# EAGLE design LM13700 VCA exp only (EAGLE 7.4.0)
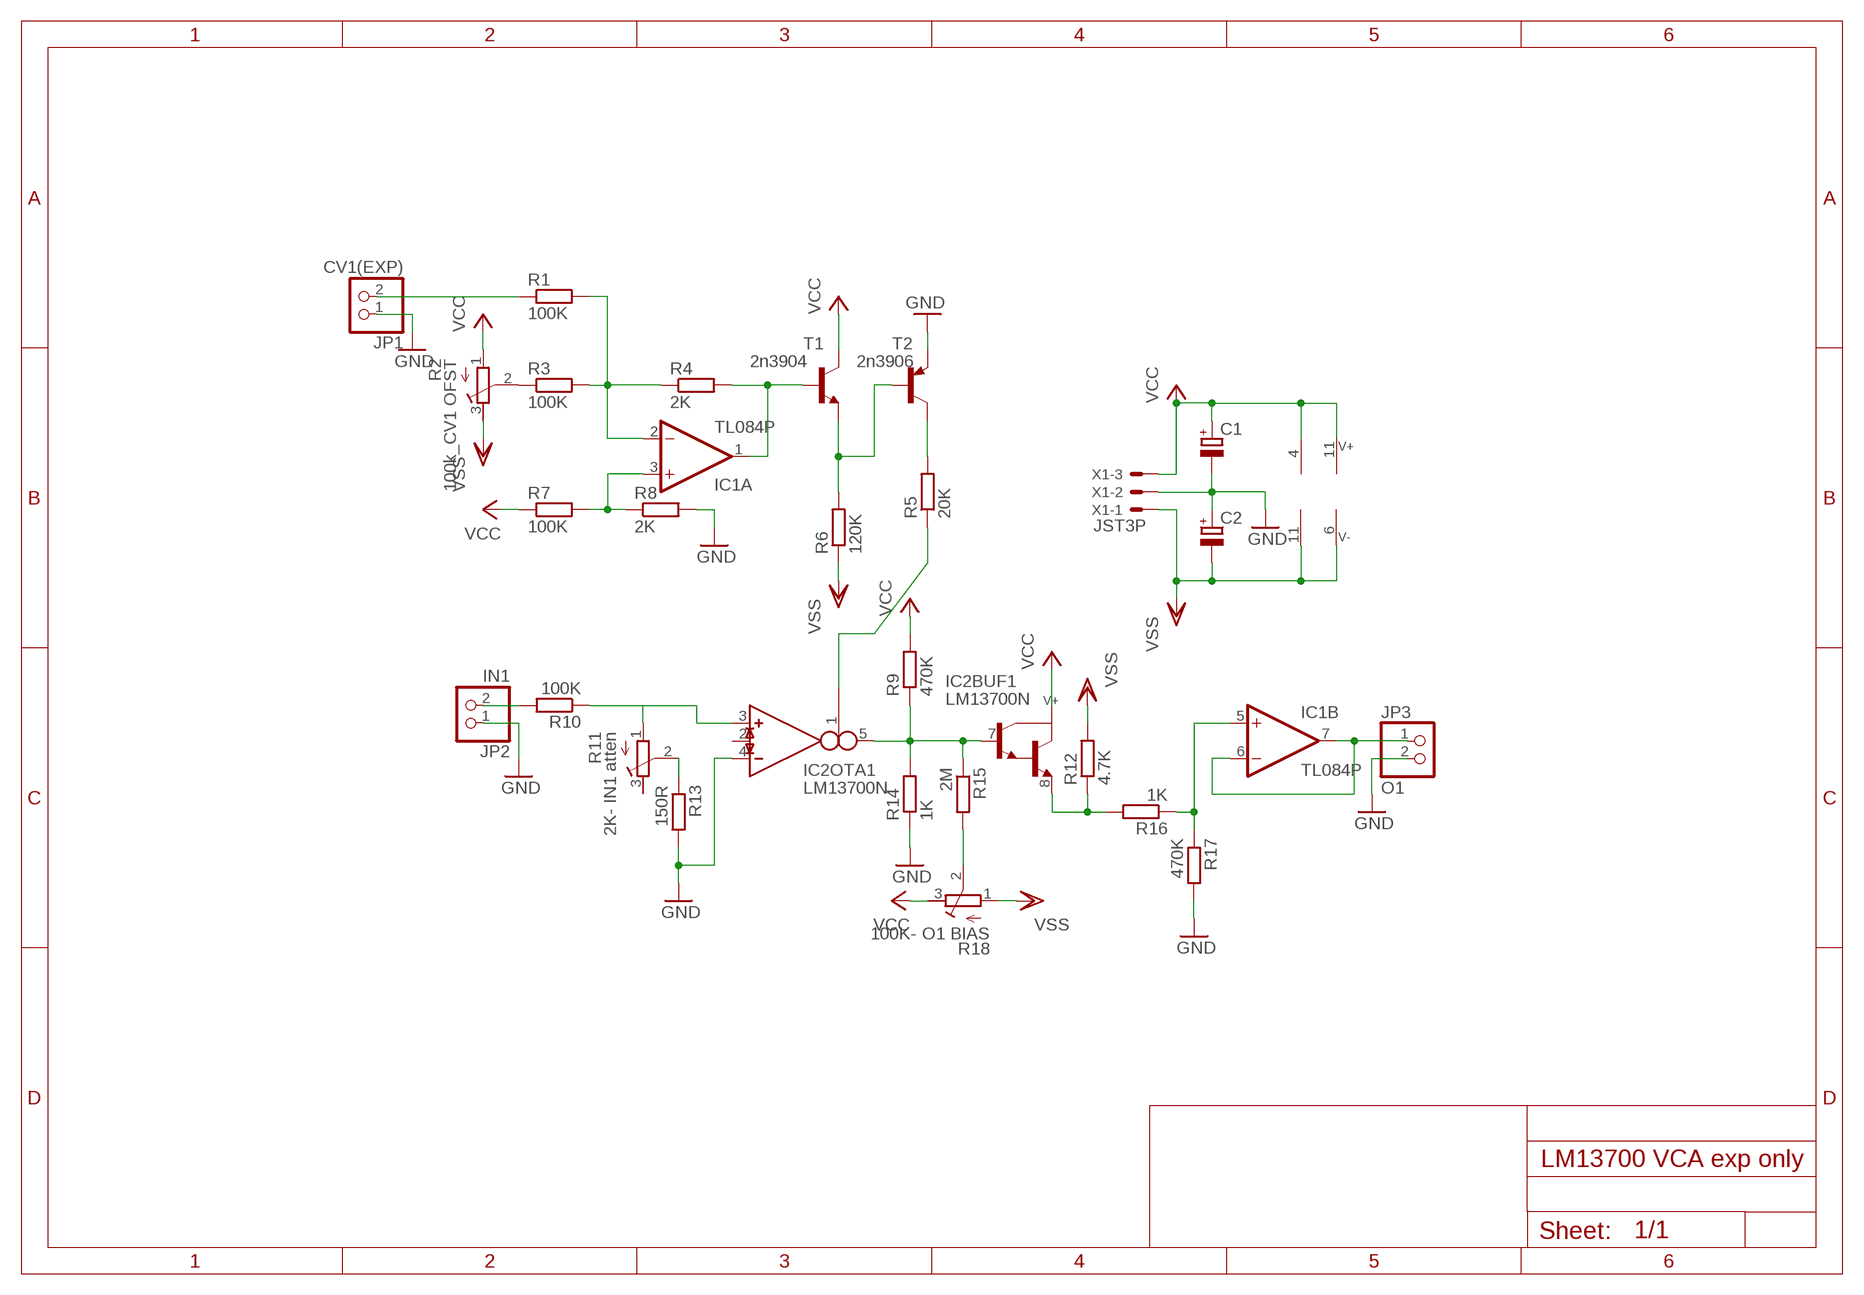
[diagram p0: schematic, sheet 1]

## Parts
C1  CPOL-EUE2.5-7  [E2,5-7]
C2  CPOL-EUE2.5-7  [E2,5-7]
IC1  TL084P  [DIL14]
IC2  LM13700N  [DIL16]
JP1  CV1(EXP)  PINHD-1X2  [1X02]
JP2  IN1  PINHD-1X2  [1X02]
JP3  O1  PINHD-1X2  [1X02]
R1  100K  R-EU_0204/2V  [0204V]
R2  100k_CV1 OFST  R-TRIMM64W  [RTRIM64W]
R3  100K  R-EU_0204/7  [0204/7]
R4  2K  R-EU_0204/2V  [0204V]
R5  20K  R-EU_0204/7  [0204/7]
R6  120K  R-EU_0204/7  [0204/7]
R7  100K  R-EU_0204/7  [0204/7]
R8  2K  R-EU_0204/7  [0204/7]
R9  470K  R-EU_0204/7  [0204/7]
R10  100K  R-EU_0204/2V  [0204V]
R11  2K- IN1 atten  R-TRIMM64W  [RTRIM64W]
R12  4.7K  R-EU_0204/7  [0204/7]
R13  150R  R-EU_0204/2V  [0204V]
R14  1K  R-EU_0204/2V  [0204V]
R15  2M  R-EU_0204/7  [0204/7]
R16  1K  R-EU_0204/7  [0204/7]
R17  470K  R-EU_0204/7  [0204/7]
R18  100K- O1 BIAS  R-TRIMM64W  [RTRIM64W]
T1  2n3904  2N3904-NPN-TO92-EBC  [TO92-EBC]
T2  2n3906  2N3906-PNP-TO92-EBC  [TO92-EBC]
X1  JST3P  JST-XH-03-PIN-LONG-PAD  [JST-XH-03-PACKAGE-LONG-PAD]

## Nets
GND: C1.- C2.+ IC2.4(OTA1:IN_N) JP1.1 JP2.1 JP3.2 R8.2 R13.2 R14.1 R17.2 T2.E X1.2
N$1: IC1.3(A:+IN) R7.2 R8.1
N$2: IC1.2(A:-IN) R1.2 R3.2 R4.1
N$3: IC1.1(A:OUT) R4.2 T1.B
N$4: R6.2 T1.E T2.B
N$5: R5.2 T2.C
N$6: JP1.2 R1.1
N$7: R2.2(S) R3.1
N$8: IC2.1(OTA1:I_BIAS) R5.1
N$9: IC2.3(OTA1:IN_P) R10.1 R11.1(A)
N$11: IC2.8(BUF1:E) R12.1 R16.2
N$12: IC2.5(OTA1:OUT) IC2.7(BUF1:B) R9.1 R14.2 R15.1
N$13: R15.2 R18.2(S)
N$16: IC1.5(B:+IN) R16.1 R17.1
N$17: IC1.6(B:-IN) IC1.7(B:OUT) JP3.1
N$18: JP2.2 R10.2
N$37: R11.2(S) R13.1
V-: C2.- IC1.11(P:V-) IC2.6(SUPPLY:V-) X1.1 ; supply symbol labelled VSS
VCC: C1.+ IC1.4(P:V+) IC2.11(SUPPLY:V+) R2.1(A) R7.1 R9.2 R18.3(E) T1.C X1.3
VSS: R2.3(E) R6.1 R12.2 R18.1(A)
Unconnected: IC1.8(C:OUT) IC1.9(C:-IN) IC1.10(C:+IN) IC1.12(D:+IN) IC1.13(D:-IN) IC1.14(D:OUT) IC2.2(OTA1:I_DIODE) IC2.9(BUF2:E) IC2.10(BUF2:B) IC2.12(OTA2:OUT) IC2.13(OTA2:IN_N) IC2.14(OTA2:IN_P) IC2.15(OTA2:I_DIODE) IC2.16(OTA2:I_BIAS) R11.3(E)

## Library data of the parts
C1 C2 = rcl:CPOL-EU: POLARIZED CAPACITOR, European symbol
IC1 = linear:TL084: OP AMP
IC2 = ota:LM13700: Dual OTA with buffers
JP1-JP3 = pinhead:PINHD-1X2: PIN HEADER
R1 R3-R10 R12-R17 = rcl:R-EU_: RESISTOR, European symbol
R2 R11 R18 = resistor:R-TRIMM: Trimm resistor
T1 = transistor-neu-to92:*-NPN-: NPN Transistror
T2 = transistor-neu-to92:*-PNP-: PNP Transistror
X1 = Rembrandt Electronics - JST XH Connectors v1-0:JST-XH-03-PIN: JST XH Connector 2 Pin Wire to board connector. Pitch: 2,54 mm, (0.100") Number of pins: 3 Created by Rembrandt Electronics www.rembrandtelectronics.com

## Board
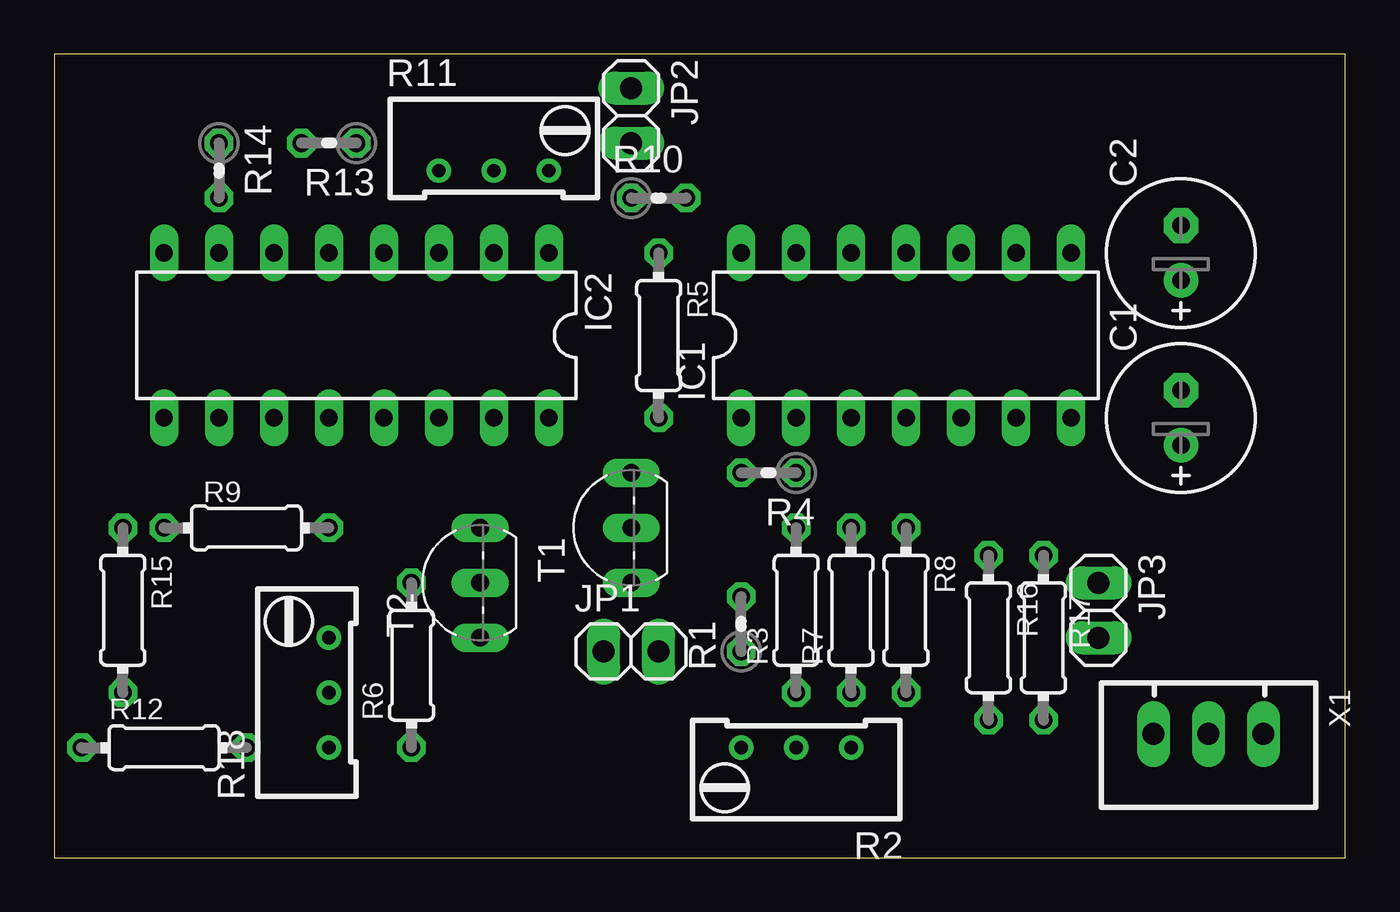
[diagram p1: board, top side]
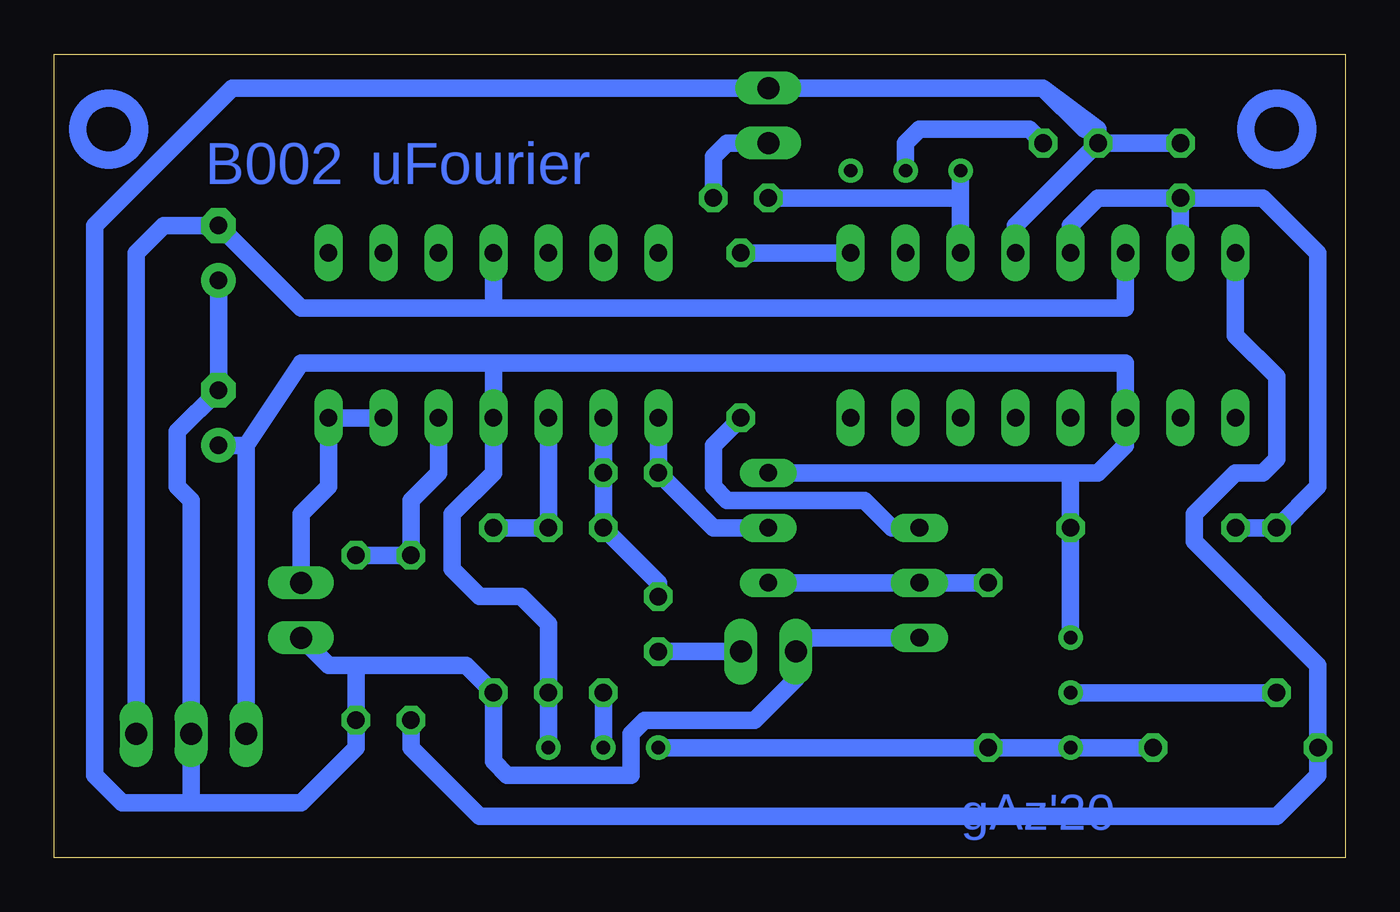
[diagram p2: board, bottom side, seen from below]

Size 59.67 x 37.13 mm. Coordinates in mm from the lower left corner, seen from the top.
Outline: 0,0 59.67,0 59.67,37.13 0,37.13 0,0
Copper layers (1*16): Top 0.035mm / dielectric 1.5mm / Bottom 0.035mm
Design rules "default": minimum track width 10mil, minimum drill 24mil, track to track 8mil, track to pad 8mil, pad to pad 8mil, via to via 8mil, smd to smd 8mil, copper to edge 40mil, drill to drill 8mil, minimum pad ring 10mil, minimum via ring 8mil, stop-mask expansion 4mil, vias tented up to drill 0mil, thermal gap 10mil

### Footprints (pad centres in the part's own frame; a part is rotated, then mirrored left to right if it is on the bottom)
E2,5-7 = drill 0.813 pad 1.6: + -1.27,0 | drill 0.813 pad 1.6 octagon: - 1.27,0
DIL14 = drill 0.813 long: 1 -7.62,-3.81; 2 -5.08,-3.81; 3 -2.54,-3.81; 4 0,-3.81; 5 2.54,-3.81; 6 5.08,-3.81; 7 7.62,-3.81; 8 7.62,3.81; 9 5.08,3.81; 10 2.54,3.81; 11 0,3.81; 12 -2.54,3.81; 13 -5.08,3.81; 14 -7.62,3.81
DIL16 = drill 0.813 long: 1 -8.89,-3.81; 2 -6.35,-3.81; 3 -3.81,-3.81; 4 -1.27,-3.81; 5 1.27,-3.81; 6 3.81,-3.81; 7 6.35,-3.81; 8 8.89,-3.81; 9 8.89,3.81; 10 6.35,3.81; 11 3.81,3.81; 12 1.27,3.81; 13 -1.27,3.81; 14 -3.81,3.81; 15 -6.35,3.81; 16 -8.89,3.81
1X02 = drill 1.016 long: 1 -1.27,0; 2 1.27,0
0204V = drill 0.813 octagon: 1 -1.27,0; 2 1.27,0
RTRIM64W = drill 0.61: 1 1.27,-2.54; 2 1.27,0; 3 1.27,2.54
0204/7 = drill 0.813 octagon: 1 -3.81,0; 2 3.81,0
TO92-EBC = drill 0.813 long: B 0,-1.27; C 2.54,-1.27; E -2.54,-1.27
JST-XH-03-PACKAGE-LONG-PAD = drill 1.016 long: 1 -2.54,0; 2 0,0; 3 2.54,0

### Placement (x,y rotation side)
C1  52.07,20.32 90 top
C2  52.07,27.94 90 top
IC1  39.37,24.13 0 top
IC2  13.97,24.13 180 top
JP1  26.67,9.53 0 top
JP2  26.67,34.29 270 top
JP3  48.26,11.43 270 top
R1  31.75,10.79 90 top
R2  34.29,3.81 90 top
R3  34.29,11.43 90 top
R4  33.02,17.78 180 top
R5  27.94,24.13 270 top
R6  16.51,8.89 90 top
R7  36.83,11.43 90 top
R8  39.37,11.43 270 top
R9  8.89,15.24 0 top
R10  27.94,30.48 0 top
R11  20.32,33.02 270 top
R12  5.08,5.08 0 top
R13  12.7,33.02 180 top
R14  7.62,31.75 270 top
R15  3.17,11.43 270 top
R16  43.18,10.16 270 top
R17  45.72,10.16 270 top
R18  11.43,7.62 0 top
T1  25.4,15.24 90 top
T2  18.41,12.7 90 top
X1  53.34,5.71 180 top

### Tracks (layer width: path | path; a pad name or v marks a point on that pad's centre or on a via)
GND
  Bottom 0.813: C2.+ C1.- 53.98,19.68 53.98,17.14 53.34,16.51 X1.2 53.34,2.54 | R14.1 R13.2 | 11.43,33.66 13.97,35.56 | 13.97,35.56 JP2.1 51.44,35.56 57.78,29.21 57.78,3.81 56.52,2.54 53.34,2.54 | 45.72,8.89 40.64,8.89 R8.2 39.37,4.45 38.73,3.81 33.02,3.81 33.02,5.71 32.38,6.35 27.3,6.35 25.4,8.26 JP1.1 24.77,10.16 T2.E | JP3.2 46.99,8.89 45.72,8.89 | 45.72,8.89 R17.2 45.72,5.08 48.26,2.54 53.34,2.54 | IC2.4 15.24,29.21 R13.2 | R13.2 11.43,33.66 | 11.43,33.66 12.06,33.66 13.97,35.56
N$1
  Bottom 0.813: R8.1 R7.2 IC1.3
N$2
  Bottom 0.813: IC1.2 R4.1 R3.2 32.38,13.34 31.75,12.7 R1.2
N$3
  Bottom 0.813: IC1.1 R4.2 29.21,15.24 T1.B
N$4
  Bottom 0.813: R6.2 T2.B T1.E
N$5
  Bottom 0.813: T2.C 20.95,15.24 22.23,16.51 28.57,16.51 29.21,17.14 29.21,19.05 R5.2
N$6
  Bottom 0.813: JP1.2 R1.1
N$7
  Bottom 0.813: R2.2 R3.1
N$8
  Bottom 0.813: IC2.1 R5.1
N$9
  Bottom 0.813: 17.78,30.48 IC2.3 | R11.1 17.78,30.48 | 17.78,30.48 R10.1
N$11
  Bottom 0.813: R16.2 43.18,5.08 40.01,1.91 3.17,1.91 1.27,3.81 R12.1 1.27,8.89 6.99,14.61 6.99,15.88 5.08,17.78 3.81,17.78 3.17,18.41 3.17,22.23 5.08,24.13 IC2.8
N$12
  Bottom 0.813: IC2.5 12.7,29.21 11.43,30.48 R14.2 | R14.2 IC2.7 | R14.2 3.81,30.48 1.27,27.94 1.27,17.14 R15.1 R9.1
N$13
  Bottom 0.813: R18.2 R15.2
N$16
  Bottom 0.813: IC1.5 41.91,17.78 43.18,16.51 R16.1 R17.1
N$17
  Bottom 0.813: IC1.6 IC1.7 46.99,17.14 48.26,15.88 JP3.1
N$18
  Bottom 0.813: JP2.2 28.57,33.02 29.21,32.38 R10.2
N$37
  Bottom 0.813: R11.2 20.32,33.02 19.68,33.66 14.61,33.66 R13.1
V-
  Bottom 0.813: 39.37,25.4 10.16,25.4 IC2.6 | IC1.11 39.37,25.4 | 39.37,25.4 48.26,25.4 C2.- 54.61,29.21 55.88,27.94 X1.1
VCC
  Bottom 0.813: 39.37,22.86 IC1.4 39.37,17.78 41.27,15.88 41.27,13.34 40.01,12.06 38.1,12.06 36.83,10.79 R7.1 R2.1 | X1.3 50.8,19.05 | 39.37,22.86 10.16,22.86 IC2.11 10.16,19.05 11.43,17.78 12.7,17.78 | C1.+ 50.8,19.05 | 50.8,19.05 48.26,22.86 39.37,22.86 | 12.7,17.78 T1.C | R18.3 R9.2 12.7,17.78
VSS
  Bottom 0.813: R2.3 R6.1 R18.1 R12.2
(copper drawn outside any net)
  shapes: Bottom circle x2

### Text on the board
Bottom: uFourier | B002 | gAz'20